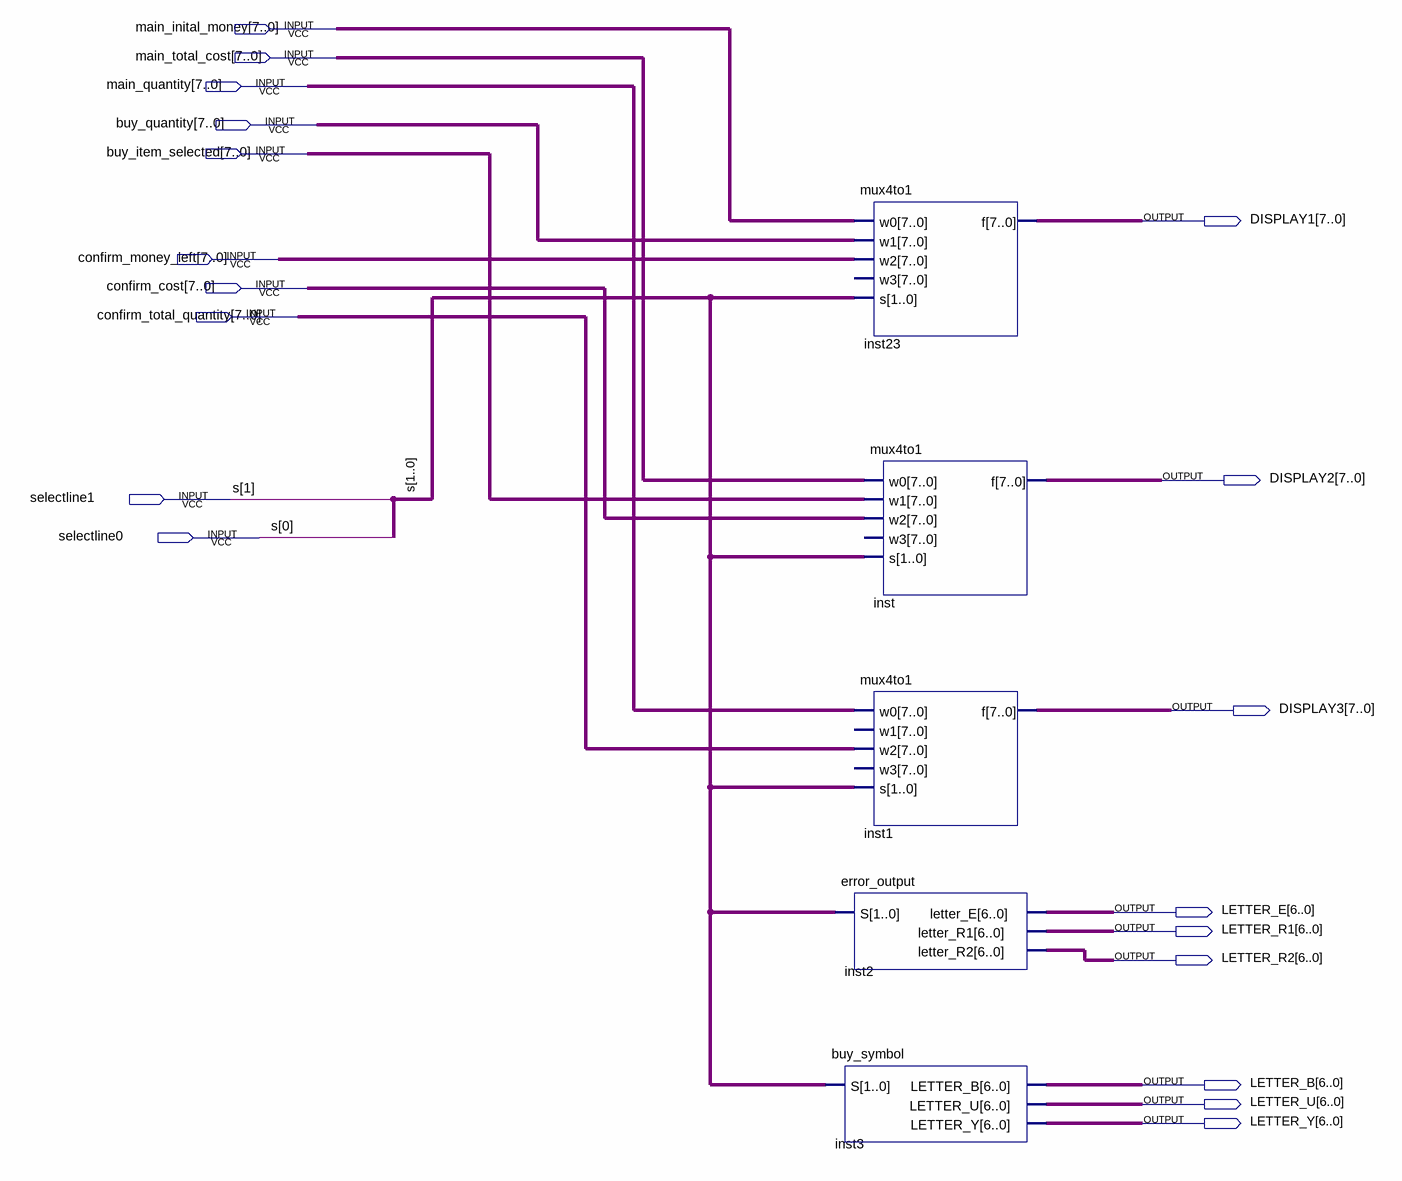
[diagram p0: schematic sheet]
// Quartus schematic display_menu.bdf as structural Verilog: 5 symbols, 19 pins
module display_menu (
  input  [7:0] main_inital_money,
  input  [7:0] main_total_cost,
  input  [7:0] main_quantity,
  input  [7:0] buy_quantity,
  input  [7:0] buy_item_selected,
  input  [7:0] confirm_money_left,
  input  [7:0] confirm_cost,
  input  [7:0] confirm_total_quantity,
  input  selectline1,
  input  selectline0,
  output [7:0] DISPLAY1,
  output [7:0] DISPLAY2,
  output [7:0] DISPLAY3,
  output [6:0] LETTER_E,
  output [6:0] LETTER_R1,
  output [6:0] LETTER_R2,
  output [6:0] LETTER_B,
  output [6:0] LETTER_U,
  output [6:0] LETTER_Y
);

  mux4to1 inst23 (
    .w0(main_inital_money), .w1(buy_quantity), .w2(confirm_money_left), .s({selectline1, selectline0}),
    .f(DISPLAY1));  // open: w3
  mux4to1 inst (
    .w0(main_total_cost), .w1(buy_item_selected), .w2(confirm_cost), .s({selectline1, selectline0}),
    .f(DISPLAY2));  // open: w3
  mux4to1 inst1 (
    .w0(main_quantity), .w2(confirm_total_quantity), .s({selectline1, selectline0}), .f(DISPLAY3));  // open: w1, w3
  error_output inst2 (
    .S({selectline1, selectline0}), .letter_E(LETTER_E), .letter_R1(LETTER_R1), .letter_R2(LETTER_R2));
  buy_symbol inst3 (.S({selectline1, selectline0}), .LETTER_B(LETTER_B), .LETTER_U(LETTER_U), .LETTER_Y(LETTER_Y));

  // Other names for the same wires on the sheet: s[1:0] = {selectline1, selectline0}
endmodule
